# Altium schematic sheet Connectors.SchDoc
size A4
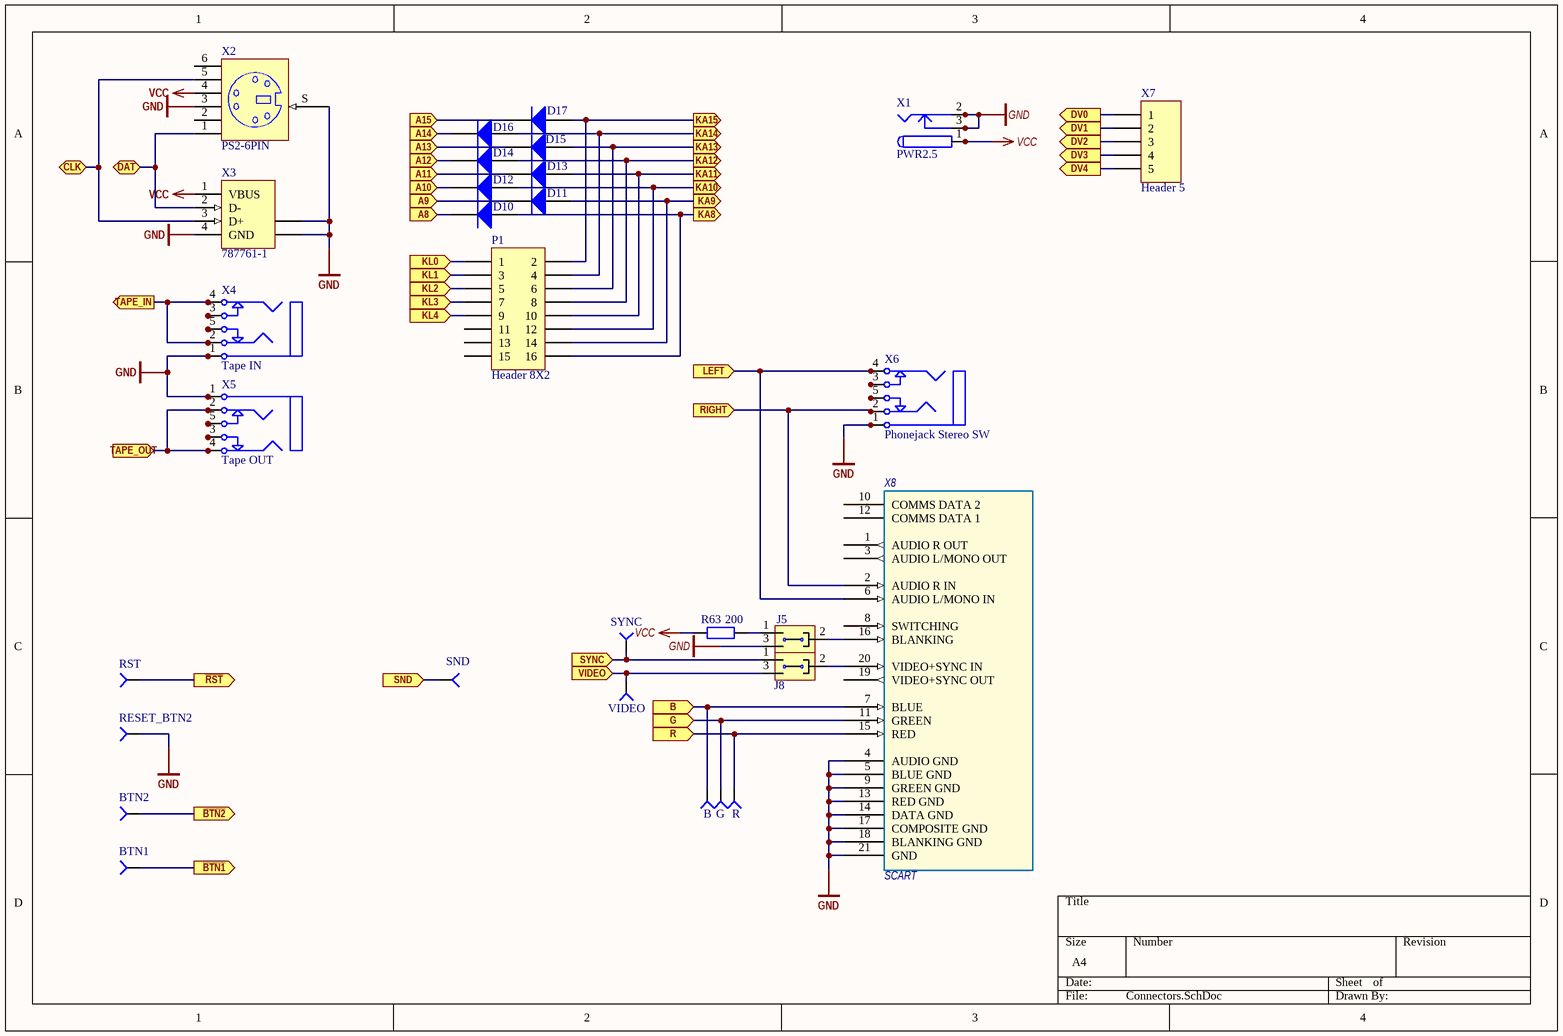
[diagram p0: Connectors.SchDoc]

## Parts
B  (no value)  [PIN1]
BTN1  Socket  [PIN1]  (value not drawn)
BTN2  Socket  [PIN1]  (value not drawn)
D10  Diode 1N4148  [DO-35]  (value not drawn)
D11  Diode 1N4148  [DO-35]  (value not drawn)
D12  Diode 1N4148  [DO-35]  (value not drawn)
D13  Diode 1N4148  [DO-35]  (value not drawn)
D14  Diode 1N4148  [DO-35]  (value not drawn)
D15  Diode 1N4148  [DO-35]  (value not drawn)
D16  Diode 1N4148  [DO-35]  (value not drawn)
D17  Diode 1N4148  [DO-35]  (value not drawn)
G  (no value)  [PIN1]
J5  Jump3  [MHDR1X3]  (value not drawn)
J8  Jump3  [MHDR1X3]  (value not drawn)
P1  Header 8X2  [HDR2X8]
R  (no value)  [PIN1]
R63  value 200  [AXIAL-0.4]  (hidden comment: Res2)
RESET_BTN2  (no value)  [PIN1]
RST  (no value)  [PIN1]
SND  (no value)  [PIN1]
SYNC  (no value)  [PIN1]
VIDEO  (no value)  [PIN1]
X1  PWR2.5  [KLD-0202]
X2  PS2-6PIN  [PS2-6PIN]
X3  787761-1  [787761]
X4  Tape IN  [ST-3150-5N]
X5  Tape OUT  [ST-3150-5N]
X6  Phonejack Stereo SW  [ST-3150-5N]
X7  Header 5  [HDR1X5]
X8  SCART  [SCART]

## Ports
A8 (in), A9 (in), A10 (in), A11 (in), A12 (in), A13 (in), A14 (in), A15 (in), B (in), CLK (bidir), DAT (bidir), DV0 (out), DV1 (out), DV2 (out), DV3 (out), DV4 (out), G (in), KA8 (out), KA9 (out), KA10 (out), KA11 (out), KA12 (out), KA13 (out), KA14 (out), KA15 (out), KL0 (in), KL1 (in), KL2 (in), KL3 (in), KL4 (in), LEFT (in), R (in), RIGHT (in), SND (in), SYNC (in), TAPE_IN (out), TAPE_OUT (in), VIDEO (in), ~{BTN1} (out), ~{BTN2} (out), ~{RST} (out)

## Nets
GND: J5.3 RESET_BTN2.1 X1.2 X1.2A X1.2B X1.3 X1.3A X1.3B X2.3 X2.S X3.4(GND) X3.5(SHLD) X3.6(SHLD) X4.1 X4.1A X4.1B X5.1 X5.1A X5.1B X6.1 X6.1A X6.1B X8.4(AUDIO_GND) X8.5(BLUE_GND) X8.9(GREEN_GND) X8.13(RED_GND) X8.14(DATA_GND) X8.17(COMPOSITE_GND) X8.18(BLANKING_GND) X8.21(GND)
VCC: R63.1 X1.1 X1.1A X1.1B X2.4 X3.1(VBUS)
A8: D10.2(K) ; port A8
A9: D11.2(K) ; port A9
A10: D12.2(K) ; port A10
A11: D13.2(K) ; port A11
A12: D14.2(K) ; port A12
A13: D15.2(K) ; port A13
A14: D16.2(K) ; port A14
A15: D17.2(K) ; port A15
B: B.1 X8.7(BLUE) ; port B
~{BTN1}: BTN1.1 ; port ~{BTN1}
~{BTN2}: BTN2.1 ; port ~{BTN2}
CLK: X2.5 X3.3(D+) ; port CLK
DAT: X2.1 X3.2(D-) ; port DAT
DV0: X7.1 ; port DV0
DV1: X7.2 ; port DV1
DV2: X7.3 ; port DV2
DV3: X7.4 ; port DV3
DV4: X7.5 ; port DV4
G: G.1 X8.11(GREEN) ; port G
KA8: D10.1(A) P1.16 ; port KA8
KA9: D11.1(A) P1.14 ; port KA9
KA10: D12.1(A) P1.12 ; port KA10
KA11: D13.1(A) P1.10 ; port KA11
KA12: D14.1(A) P1.8 ; port KA12
KA13: D15.1(A) P1.6 ; port KA13
KA14: D16.1(A) P1.4 ; port KA14
KA15: D17.1(A) P1.2 ; port KA15
KL0: P1.1 ; port KL0
KL1: P1.3 ; port KL1
KL2: P1.5 ; port KL2
KL3: P1.7 ; port KL3
KL4: P1.9 ; port KL4
LEFT: X6.4 X6.4A X6.4B X8.6(AUDIO_L/MONO_IN) ; port LEFT
R: R.1 X8.15(RED) ; port R
~{RST}: RST.1 ; port ~{RST}
RIGHT: X6.2 X6.2A X6.2B X8.2(AUDIO_R_IN) ; port RIGHT
SND: SND.1 ; port SND
SYNC: J8.1 SYNC.1 ; port SYNC
TAPE_IN: X4.2 X4.2A X4.2B X4.4 X4.4A X4.4B ; port TAPE_IN
TAPE_OUT: X5.2 X5.2A X5.2B X5.4 X5.4A X5.4B ; port TAPE_OUT
VIDEO: J8.3 VIDEO.1 ; port VIDEO
NetJ5_1: J5.1 R63.2
NetJ5_2: J5.2 X8.16(BLANKING)
NetJ8_2: J8.2 X8.20(VIDEO+SYNC_IN)
NetX4_3: X4.3 X4.3A X4.3B
NetX4_5: X4.5 X4.5A X4.5B
NetX5_3: X5.3 X5.3A X5.3B
NetX5_5: X5.5 X5.5A X5.5B
NetX6_3: X6.3 X6.3A X6.3B
NetX6_5: X6.5 X6.5A X6.5B

Not connected (* = marked no-connect by the designer): P1 11 13 15; X2 2 6; X8 1(AUDIO_R_OUT) 3(AUDIO_L/MONO_OUT) 8(SWITCHING) 10(COMMS_DATA_2) 12(COMMS_DATA_1) 19(VIDEO+SYNC_OUT)

## Library data of the parts
B G R RESET_BTN2 RST SND SYNC VIDEO = Socket: LatestRevisionDate: 17-Jul-2002; LatestRevisionNote: Re-released for DXP Platform.; Publisher: Altium Limited
D10-D17 = Diode 1N4148: High Conductance Fast Diode; Published: 8-Jun-2000; LatestRevisionDate: 17-Jul-2002; LatestRevisionNote: Re-released for DXP Platform.; DatasheetVersion: 1997; PackageReference: DO-35; Publisher: Altium Limited; PackageDescription: Diode, Axial; Body 3.8 x 1.9 mm (LxDia. max), Lead Dia. 0.53 mm (max); Code_JEDEC: DO-204-AH; ComponentLink1Description: Manufacturer Link; ComponentLink1URL: http://www.fairchildsemi.com/; ComponentLink2Description: Datasheet; ComponentLink2URL: http://www.fairchildsemi.com/ds/1N%2F1N4148.pdf
P1 = Header 8X2: Header, 8-Pin, Dual row; LatestRevisionDate: 17-Jul-2002; LatestRevisionNote: Re-released for DXP Platform.; Publisher: Altium Limited
R63 = Res2: Resistor; Published: 8-Jun-2000; LatestRevisionDate: 17-Jul-2002; LatestRevisionNote: Re-released for DXP Platform.; PackageReference: AXIAL-0.4; Publisher: Altium Limited; PackageDescription: Axial Device, Thru-Hole; 2 Leads; 0.4 in Pin Spacing
X1 = PWR2.5: Low Voltage Power Supply Connector; Published: 17-Dec-2003; DatasheetDocument: 09-May-2002; Publisher: Altium Limited; ComponentLink1Description: Manufacturer Link; ComponentLink1URL: http://domino.kycon.com/internet/Products.html
X2 = PS2-6PIN: 6 Pin Through Hole PS2 Socket (Kycon P/N); Published: 17-Dec-2003; Publisher: Altium Limited; ComponentLink1Description: Manufacturer Link; ComponentLink1URL: http://www.oupiin.com/prodindx.html#Headers
X3 = 787761-1: USB 1.1, Right Angle, Thru-Hole, A Type, Receptacle, 4 Position, Black; ContactMaterial: Copper Alloy; ContactPlating: Gold Flash over Palladium Nickel or Gold (30) over Nickel; TerminationLength: 2.84mm [0.112in.]; PCB_Layout: Complies with manufacturer's recommendation.; DrillSize: Corresponds to nominal value.; PanelGround: Without; Published: 15-Jul-2004; DatasheetDocument: 11-Jan-2004; PackageDocument: 11-Jan-2004; PackageReference: 787761; Publisher: Altium Limited; HousingMaterial: Thermoplastic; ComponentLink1Description: Manufacturer Link; ComponentLink1URL: http://www.tycoelectronics.com/; ComponentLink2Description: Packaging Specification; ComponentLink2URL: http://ecommas.tycoelectronics.com/commerce/DocumentDelivery/DDEController?Action=showdoc&DocId=Customer+Drawing%7F787761%7FH%7Ftif%7FEnglish%7FENG_CD_787761_H.tif
X4-X6 = Phonejack Stereo SW: 3-Conductor Jack with 2 break contacts (normals) and 2 auxiliary make contacts; Published: 5-Jan-2004; LatestRevisionDate: 17-Dec-2003; LatestRevisionNote: PCB Footprint replaced.; DatasheetDocument: 07-Mar-2000; Publisher: Altium Limited; ComponentLink1Description: Manufacturer Link; ComponentLink1URL: http://domino.kycon.com/internet/Products.html
X7 = Header 5: Header, 5-Pin; LatestRevisionDate: 17-Jul-2002; LatestRevisionNote: Re-released for DXP Platform.; Publisher: Altium Limited
BTN1 BTN2 = Socket: LatestRevisionDate: 17-Jul-2002; LatestRevisionNote: Re-released for DXP Platform.; Publisher: Altium Limited